# Altium schematic sheet Curr_Volt_Measurement.SchDoc
size A4; CompanyName: Technische Hochschule Nürnberg Georg Simon Ohm; Organization: UltraZohm; Address1: Kesslerplatz 12; Address2: 90489 Nürnberg; Address3: GERMANY; SheetNumber: 6; SheetTotal: 7; Website: www.ultrazohm.com
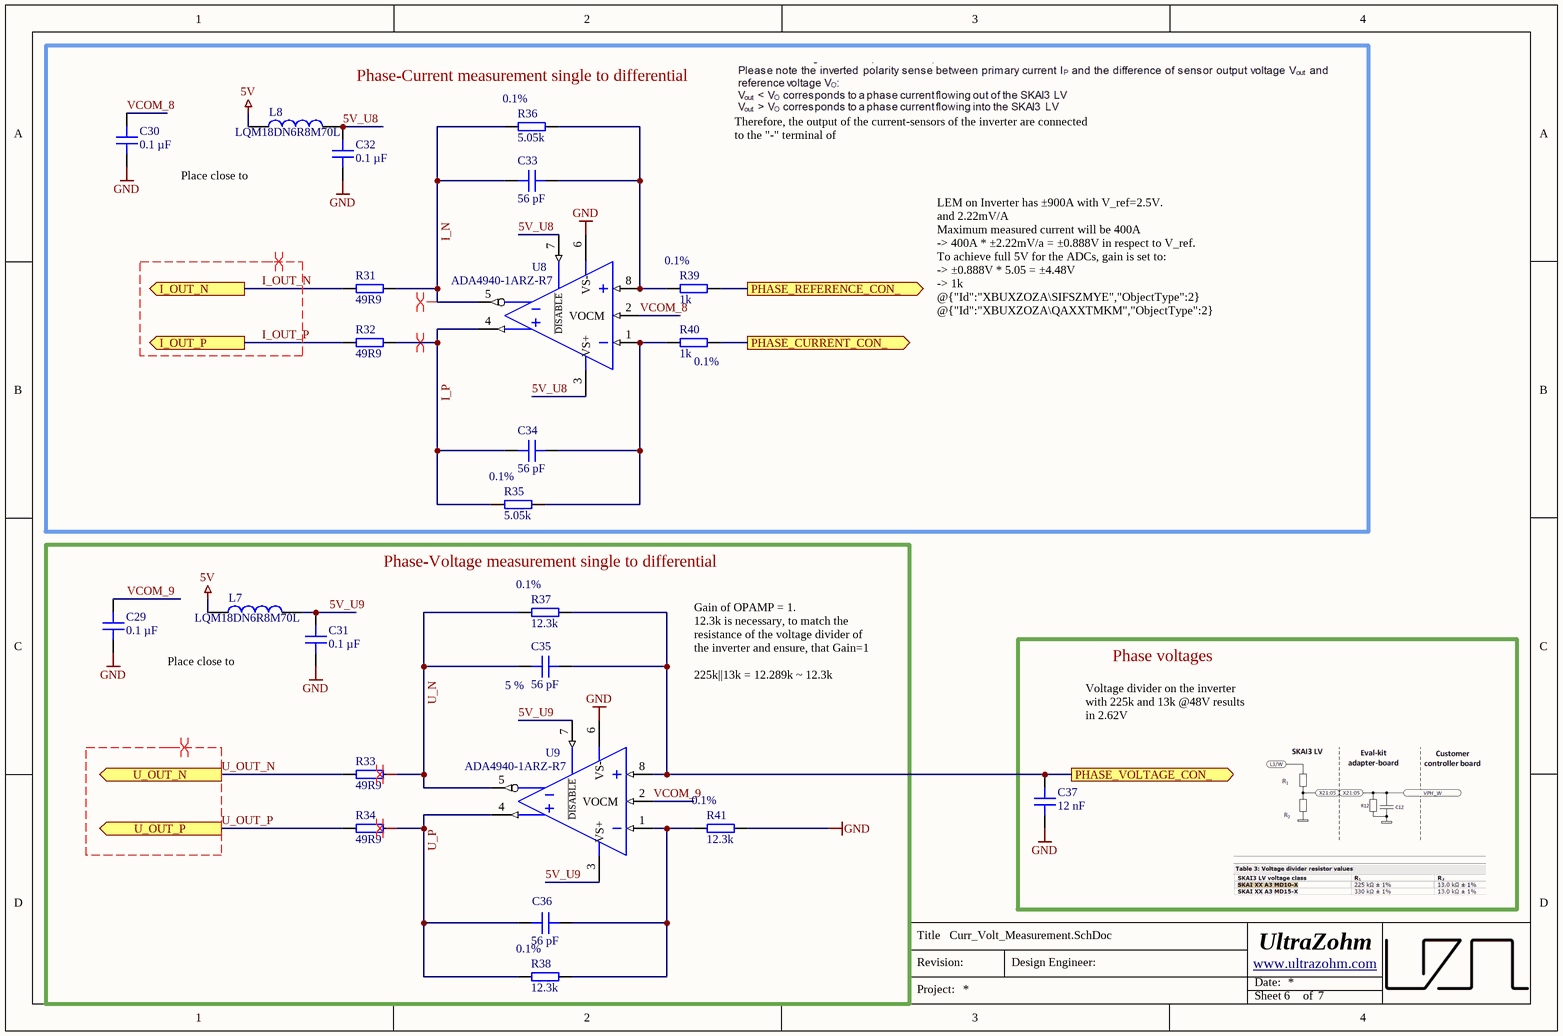
[diagram p0: Curr_Volt_Measurement.SchDoc]

## Parts
C29  0.1 µF  [C_0603]
C30  0.1 µF  [C_0603]
C31  0.1 µF  [C_0603]
C32  0.1 µF  [C_0603]
C33  56 pF  [C_0603]
C34  56 pF  [C_0603]
C35  56 pF  Tolerance: 5 %  [C_0603]
C36  56 pF  [C_0603]
C37  12 nF  [C_0603]
L7  LQM18DN6R8M70L  [INDC1608X95N]
L8  LQM18DN6R8M70L  [INDC1608X95N]
R31  49R9  [RES 0603_1608]
R32  49R9  [RES 0603_1608]
R33  49R9  [RES 0603_1608]
R34  49R9  [RES 0603_1608]
R35  5.05k  Tolerance: 0.1%  [RES 0603_1608]
R36  5.05k  Tolerance: 0.1%  [RES 0603_1608]
R37  12.3k  Tolerance: 0.1%  [RES 0603_1608]
R38  12.3k  Tolerance: 0.1%  [RES 0603_1608]
R39  1k  Tolerance: 0.1%  [RES 0603_1608]
R40  1k  Tolerance: 0.1%  [RES 0603_1608]
R41  12.3k  Tolerance: 0.1%  [RES 0603_1608]
U8  ADA4940-1ARZ-R7  [SOT127P600X175-8N]
U9  ADA4940-1ARZ-R7  [SOT127P600X175-8N]

## Blocks framed on the sheet
Phase-Current measurement single to differential: C30 C32-C34 L8 R31 R32 R35 R36 R39 R40 U8
Phase-Voltage measurement single to differential: C29 C31 C35 C36 L7 R33 R34 R37 R38 R41 U9
Phase voltages: C37

## Ports
I_OUT_N (out), I_OUT_P (out), PHASE_CURRENT_CON_ (out), PHASE_REFERENCE_CON_ (out), PHASE_VOLTAGE_CON_ (out), U_OUT_N (out), U_OUT_P (out)

## Nets
5V: L7.1 L8.1
GND: C29.1 C30.1 C31.1 C32.1 C37.1 R41.2 U8.6(VS-) U9.6(VS-)
5V_U8: C32.2 L8.2 U8.3(VS+) U8.7(~{DISABLE})
5V_U9: C31.2 L7.2 U9.3(VS+) U9.7(~{DISABLE})
I_N: C33.1 R31.2 R36.1 U8.5(VOUT-)
I_OUT_N: R31.1 ; port I_OUT_N
I_OUT_P: R32.1 ; port I_OUT_P
I_P: C34.1 R32.2 R35.1 U8.4(VOUT+)
PHASE_CURRENT_CON_: R40.2 ; port PHASE_CURRENT_CON_
PHASE_REFERENCE_CON_: R39.2 ; port PHASE_REFERENCE_CON_
PHASE_VOLTAGE_CON_: C35.2 C37.2 R37.2 U9.8(VIN+) ; port PHASE_VOLTAGE_CON_
U_N: C35.1 R33.2 R37.1 U9.5(VOUT-)
U_OUT_N: R33.1 ; port U_OUT_N
U_OUT_P: R34.1 ; port U_OUT_P
U_P: C36.1 R34.2 R38.1 U9.4(VOUT+)
VCOM_8: C30.2 U8.2(VOCM)
VCOM_9: C29.2 U9.2(VOCM)
NetC33_2: C33.2 R36.2 R39.1 U8.8(VIN+)
NetC34_2: C34.2 R35.2 R40.1 U8.1(VIN-)
NetC36_2: C36.2 R38.2 R41.1 U9.1(VIN-)

## Layout directives
differential pair: I_N, I_OUT_N, I_OUT_P, I_P, U_N, U_OUT_N, U_OUT_P, U_P

## Notes on the sheet
- Place close to @{"Id":"XBUXZOZA\MTJQITXN","ObjectType":2}
- Therefore, the output of the current-sensors of the inverter are connected to the "-" terminal of @{"Id":"XBUXZOZA\MTJQITXN","ObjectType":2}
- LEM on Inverter has ±900A with V_ref=2.5V.
  and 2.22mV/A
  Maximum measured current will be 400A
  -> 400A * ±2.22mV/a = ±0.888V in respect to V_ref.
  To achieve full 5V for the ADCs, gain is set to:
  -> ±0.888V * 5.05 = ±4.48V
  -> 1k @{"Id":"XBUXZOZA\SIFSZMYE","ObjectType":2} @{"Id":"XBUXZOZA\QAXXTMKM","ObjectType":2}
  -> 5.05k @{"Id":"XBUXZOZA\UHEFABPJ","ObjectType":2} @{"Id":"XBUXZOZA\VOLTYTTG","ObjectType":2}
- Place close to @{"Id":"XBUXZOZA\QRBCBRVC","ObjectType":2}
- Gain of OPAMP = 1.
  12.3k is necessary, to match the resistance of the voltage divider of the inverter and ensure, that Gain=1
  225k||13k = 12.289k ~ 12.3k
- Voltage divider on the inverter with 225k and 13k @48V results in 2.62V
- Title
- Revision:
- Design Engineer:
- Date:
- Project:
- Sheet
- of

## Library data of the parts
C29-C32 = C0603X104K5RAC7411: Capacitor 0603, 50 VDC, 0.1 µF, X7R; Manufacturer: KEMET; Tolerance: 10 %; Voltage Rating: 50 VDC; Created from: MGremer; Manufacturer Part Number: C0603X104K5RAC7411; PartID: 3; Created On: 20.12.2020 13:54:13; ComponentLink1Description: Datasheet; ComponentLink1URL: https://www.mouser.de/datasheet/2/212/1/KEM_C1013_X7R_FT_CAP_SMD-1103280.pdf; Component Type: Capacitor 0603; Device Package: 0603; Last Updated: 04.03.2021 09:24:28; Mounting Type: SMD; Operating Temperature: -55 - 125°C; Series: SMD Comm X7R Flex; Supplier 1: Mouser; Supplier Part Number 1: 80-C0603X104K5R7411; Supplier 2: LCSC; Supplier Part Number 2: C14663; Type: Capacitor; Value: 0.1 µF; Live Cycle Status: 1; LCSC Part Number: C14663; Stock number: Labor SMD Container
C33 C34 C36 = CL10C560JB8NNNC: Capacitor 0603, 50 VDC, 56 pF, C0G; Manufacturer: Samsung Electro-Mechanics; Tolerance: 5 %; Voltage Rating: 50 VDC; Created from: DHufnagel; Manufacturer Part Number: CL10C560JB8NNNC; PartID: 92; Created On: 20.12.2020 13:54:13; ComponentLink1Description: Datasheet; ComponentLink1URL: https://www.mouser.de/datasheet/2/585/MLCC-1837944.pdf; Component Type: Capacitor 0603; Device Package: 0603; Last Updated: 20.12.2020 16:24:16; Mounting Type: SMD; Operating Temperature: -55 - 125°C; Series: CL; Supplier 1: Mouser; Supplier Part Number 1: 187-CL10C560JB8NNNC; Supplier 2: LCSC; Supplier Part Number 2: C39148; Type: Capacitor; Value: 56 pF; Live Cycle Status: 1; LCSC Part Number: C39148; Stock number: not stored
C35 = CL10C560JB8NNNC: Capacitor 0603, 50 VDC, 56 pF, C0G; Manufacturer: Samsung Electro-Mechanics; Voltage Rating: 50 VDC; Created from: DHufnagel; Manufacturer Part Number: CL10C560JB8NNNC; PartID: 92; Created On: 20.12.2020 13:54:13; ComponentLink1Description: Datasheet; ComponentLink1URL: https://www.mouser.de/datasheet/2/585/MLCC-1837944.pdf; Component Type: Capacitor 0603; Device Package: 0603; Last Updated: 20.12.2020 16:24:16; Mounting Type: SMD; Operating Temperature: -55 - 125°C; Series: CL; Supplier 1: Mouser; Supplier Part Number 1: 187-CL10C560JB8NNNC; Type: Capacitor; Value: 56 pF; Live Cycle Status: 1; Stock number: not stored; Supplier 2: LCSC; Supplier Part Number 2: C39148; LCSC Part Number: C39148
C37 = CC0603KRX7R7BB123: Capacitor 0603, 16 VDC, 12 nF, X7R; Manufacturer: Yageo; Tolerance: 10 %; Voltage Rating: 16 VDC; Created from: MGremer; Manufacturer Part Number: CC0603KRX7R7BB123; PartID: 47; Created On: 20.12.2020 13:54:13; ComponentLink1Description: Datasheet; ComponentLink1URL: https://www.mouser.de/datasheet/2/447/UPY-GPHC_X7R_6.3V-to-50V_18-1154002.pdf; Component Type: Capacitor 0603; Device Package: 0603; Last Updated: 16.04.2024 13:21:40; Mounting Type: SMD; Operating Temperature: -55 - 125°C; Series: CC; Supplier 1: Mouser; Supplier Part Number 1: 603-CC603KRX7R7BB123; Type: Capacitor; Value: 12 nF; Live Cycle Status: 1; LCSC Part Number: C519427; Stock number: not stored
L7 L8 = LQM18DN6R8M70L: 6.8µH, 120mA, 0603, 740mOhm, 20%; Manufacturer: Murata; MF: EPCOS / TDK; Value: 6.8uH; DCR: 320m; Rated Current: 0.85 A; Type: fixed inductor; Created from: DHufnagel; MPN: B82464G4154M; Supplier 1: Mouser; Supplier Part Number 1: 81-LQM18DN6R8M70L; Manufacturer Part Number: LQM18DN6R8M70L; PartID: 10; Created On: 19.07.2022 15:47:17; ComponentLink1Description: Datasheet; ComponentLink1URL: https://www.mouser.de/datasheet/2/281/1/JELF243B_0086-2298241.pdf; Component Type: SMD fixed inductor; Device Package: SMD; Last Updated: 15.06.2023 16:03:16; Mounting Type: SMD; Operating Temperature: -40 - 125°C; Series: LQM18DN_70; Supplier 2: Digi-Key; Supplier Part Number 2: 490-LQM18DN6R8M70LCT-ND; DC current: 120mA; Live Cycle Status: 1; Stock number: not stored; LCSC Part Number: C1881372
R31-R34 = RK73H1JTTD49R9F: SMD resistor 1%; Manufacturer: KOA Speer; Created from: DHufnagel; Manufacturer Part Number: RK73H1JTTD49R9F; PartID: 214; Created On: 14.12.2020 16:17:14; ComponentLink1Description: Datasheet; ComponentLink1URL: https://www.mouser.de/datasheet/2/219/RK73H-1825326.pdf; Component Type: SMD resistor; Device Package: 0603; Last Updated: 27.05.2022 13:46:35; Mounting Type: SMD; Supplier 1: Mouser; Supplier Part Number 1: 660-RK73H1JTTD49R9F; Supplier 2: LCSC; Supplier Part Number 2: C160046; Type: Resistor; Tolerance: 1%; Value: 49R9; Live Cycle Status: 1; Stock number: not stored; LCSC Part Number: C160046
R35 R36 = TNPW06035K05BEEA: SMD resistor 0.1%; Manufacturer: Vishay; Created from: DHufnagel; Manufacturer Part Number: TNPW06035K05BEEA; PartID: 338; Created On: 01.12.2022 09:50:56; ComponentLink1Description: Datasheet; ComponentLink1URL: https://www.vishay.com/doc?28758; Component Type: SMD resistor; Device Package: 0603; Last Updated: 03.05.2024 10:51:07; Mounting Type: SMD; Supplier 1: Mouser; Supplier Part Number 1: 71-TNPW06035K05BEEA; Type: Resistor; Value: 5.05k; Live Cycle Status: 1; Stock number: not stored; LCSC Part Number: C1693738
R37 R38 R41 = RT0603BRD0712K3L: SMD resistor E24 series 12 kOhms 100mW 0603 1%; Manufacturer: YAGEO; Created from: DHufnagel; Manufacturer Part Number: RT0603BRD0712K3L; PartID: 333; Created On: 10.02.2023 10:27:45; ComponentLink1Description: Datasheet; ComponentLink1URL: https://www.mouser.de/datasheet/2/447/PYu_RT_1_to_0_01_RoHS_L_12-3003070.pdf; Component Type: SMD resistor; Device Package: 0603; Last Updated: 03.05.2024 10:37:15; Mounting Type: SMD; Supplier 1: Mouser; Supplier Part Number 1: 603-RT0603BRD0712K3L; Type: Resistor; Value: 12.3k; Live Cycle Status: 1; Stock number: not stored; LCSC Part Number: C861101
R39 R40 = PCF-W0603LF-03-1001-B-P-LT: SMD resistor 0.1%; Manufacturer: IRC / TT Electronics; Created from: MGremer; Manufacturer Part Number: PCF-W0603LF-03-1001-B-P-LT; PartID: 163; Created On: 14.12.2020 16:17:14; ComponentLink1Description: Datasheet; ComponentLink1URL: https://www.mouser.de/datasheet/2/414/PCF-1528243.pdf; Component Type: SMD resistor; Device Package: 0603; Last Updated: 21.02.2024 15:45:55; Mounting Type: SMD; Supplier 1: Mouser; Supplier Part Number 1: 66-PCFW0603LF031001B; Type: Resistor; Value: 1k; Live Cycle Status: 1; Stock number: not stored; LCSC Part Number: C110776
U8 U9 = ADA4940-1ARZ-R7: Fully Differential Amplifier, Ultralow-Power,Low Distortion, 260-MHz; Manufacturer: Analog Devices; Channels: 1; GBP: 260 MHz; CMRR: 86 dB; Created from: DHufnagel; Manufacturer Part Number: ADA4940-1ARZ-R7; PartID: 14; Created On: 18.08.2022 12:53:27; ComponentLink1Description: Datasheet; ComponentLink1URL: https://www.mouser.de/datasheet/2/609/ada4940_1_4940_2-2955874.pdf; Component Type: Differential Amplifier; Device Package: SOIC-8; Last Updated: 18.08.2022 13:04:18; Mounting Type: SMD; Operating Temperature: -40 - 105°C; Series: ADA4940-1; Supplier 1: Mouser; Supplier Part Number 1: 584-ADA4940-1ARZ; Supplier 2: Digi-Key; Supplier Part Number 2: 505-ADA4940-1ARZ-ND; Supplier 3: LCSC; Supplier Part Number 3: C730049; Type: Differential Amplifiers; Live Cycle Status: 1; LCSC Part Number: C730049; Stock number: not stored